# Altium project Remote.PrjPcb
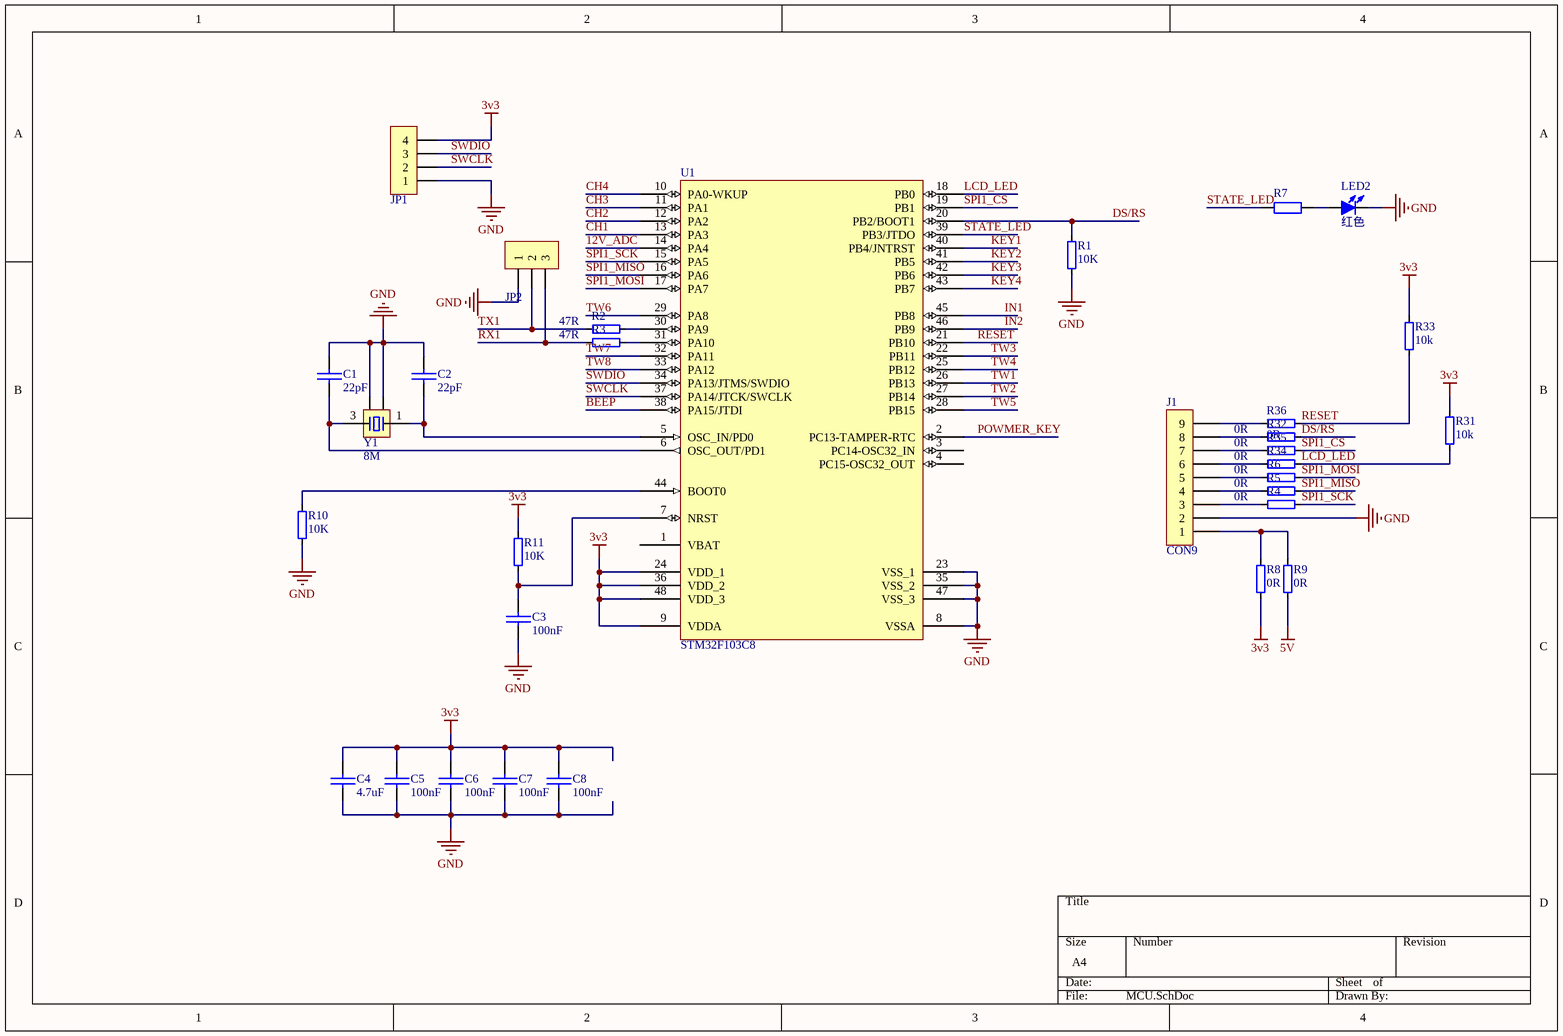
[diagram p0: MCU.SchDoc]
4 sheets, 142 parts. Net scope: global (net labels, ports and power ports of the same name join across sheets).
Board file: Remote.PcbDoc
Sheets:
  MCU.SchDoc
  INPUT.SchDoc
  COMMUNICATION.SchDoc
  POWER.SchDoc

## Sheet MCU.SchDoc
size A4; SheetNumber: 1; SheetTotal: 4

### Parts
(Parts that share a designator on the sheet are numbered #1, #2 ... from top to bottom, then left to right.)
C1  22pF  [C 0603_L]
C2  22pF  [C 0603_L]
C3  100nF  [C 0603_L]
C4  4.7uF  [C 0603_L]
C5  100nF  [C 0603_L]
C6  100nF  [C 0603_L]
C7  100nF  [C 0603_L]
C8  100nF  [C 0603_L]
J1  CON9  [HDR2.54-Y-LI-9P]
JP1  HDR-1X4  [HDR2.54-LI-4P]  (value not drawn)
JP2  HDR-1X3  [HDR2.54-LI-3P]  (value not drawn)
LED2  红色  [LED 0805G]
R1  10K  [R 0603_L]
R2  47R  [R 0603_L]
R3  47R  [R 0603_L]
R4  0R  [R 0603_L]
R5  0R  [R 0603_L]
R6  0R  [R 0603_L]
R7  (no value)  [R 0603_L]
R8  0R  [R 0603_L]
R9  0R  [R 0603_L]
R10  10K  [R 0603_L]
R11  10K  [R 0603_L]
R31  10k  [R 0603_L]
R32  0R  [R 0603_L]
R33  10k  [R 0603_L]
R34#1  0R  [R 0603_L]
R35#1  0R  [R 0603_L]
R36#1  0R  [R 0603_L]
U1  STM32F103C8  [LQFP-48_M]
Y1  8M  [OSC 3225-4P]

### Nets
3v3: C4.1 C5.1 C6.1 C7.1 C8.1 JP1.4 R8.2 R11.2 R31.1 R33.1 U1.9(VDDA) U1.24(VDD_1) U1.36(VDD_2) U1.48(VDD_3)
5V: R9.2
GND: C1.1 C2.1 C3.2 C4.2 C5.2 C6.2 C7.2 C8.2 J1.2 JP1.1 JP2.1 LED2.2(K) R1.2 R10.1 U1.8(VSSA) U1.23(VSS_1) U1.35(VSS_2) U1.47(VSS_3) Y1.2 Y1.4
12V_ADC: U1.14(PA4)
BEEP: U1.38(PA15/JTDI)
CH1: U1.13(PA3)
CH2: U1.12(PA2)
CH3: U1.11(PA1)
CH4: U1.10(PA0-WKUP)
DS/RS: R1.1 R32.1 U1.20(PB2/BOOT1)
IN1: U1.45(PB8)
IN2: U1.46(PB9)
KEY1: U1.40(PB4/JNTRST)
KEY2: U1.41(PB5)
KEY3: U1.42(PB6)
KEY4: U1.43(PB7)
LCD_LED: R31.2 R34#1.1 U1.18(PB0)
POWMER_KEY: U1.2(PC13-TAMPER-RTC)
RESET: R33.2 R36#1.2 U1.21(PB10)
RX1: JP2.3 R3.2
SPI1_CS: R35#1.1 U1.19(PB1)
SPI1_MISO: R5.1 U1.16(PA6)
SPI1_MOSI: R6.1 U1.17(PA7)
SPI1_SCK: R4.1 U1.15(PA5)
STATE_LED: R7.1 U1.39(PB3/JTDO)
SWCLK: JP1.2 U1.37(PA14/JTCK/SWCLK)
SWDIO: JP1.3 U1.34(PA13/JTMS/SWDIO)
TW1: U1.26(PB13)
TW2: U1.27(PB14)
TW3: U1.22(PB11)
TW4: U1.25(PB12)
TW5: U1.28(PB15)
TW6: U1.29(PA8)
TW7: U1.32(PA11)
TW8: U1.33(PA12)
TX1: JP2.2 R2.2
NetC1_2: C1.2 U1.6(OSC_OUT/PD1) Y1.3
NetC2_2: C2.2 U1.5(OSC_IN/PD0) Y1.1
NetC3_1: C3.1 R11.1 U1.7(NRST)
NetJ1_1: J1.1 R8.1 R9.1
NetJ1_3: J1.3 R4.2
NetJ1_4: J1.4 R5.2
NetJ1_5: J1.5 R6.2
NetJ1_6: J1.6 R34#1.2
NetJ1_7: J1.7 R35#1.2
NetJ1_8: J1.8 R32.2
NetJ1_9: J1.9 R36#1.1
NetLED2_1: LED2.1(A) R7.2
NetR2_1: R2.1 U1.30(PA9)
NetR3_1: R3.1 U1.31(PA10)
NetR10_2: R10.2 U1.44(BOOT0)

Not connected (* = marked no-connect by the designer): U1 1(VBAT) 3(PC14-OSC32_IN) 4(PC15-OSC32_OUT)

### Library data of the parts
C1-C8 = 普通电容: Capacitor
J1 = CON9: Connector
JP1 = Header 4: 4P接插件; 版权归属: 源创客; BOM名称: 4P接插件; 学习资源: www.ooocke.com
JP2 = Header 3: 3P接插件; 版权归属: 源创客; BOM名称: 3P接插件; 学习资源: www.ooocke.com
LED2 = LED-SMD: 贴片LED; 版权归属: 源创客; BOM名称: 贴片LED; 学习资源: www.ooocke.com
R1-R6 R8-R11 R31-R33 R34#1 R35#1 R36#1 = 普通电阻
R7 = R: 贴片电阻; 版权归属: 源创客; BOM名称: 贴片电阻; 学习资源: www.ooocke.com
U1 = STM32F103C8: Flaah:64/RAM:20/IO:36; BOM名称: 32位STM单片机; 版权归属: 源创客; 学习资源: www.ooocke.com
Y1 = XTAL-4P: 4脚无源晶振; 版权归属: 源创客; BOM名称: 4脚无源晶振; 学习资源: www.ooocke.com

## Sheet INPUT.SchDoc
size A4; SheetNumber: 2; SheetTotal: 4
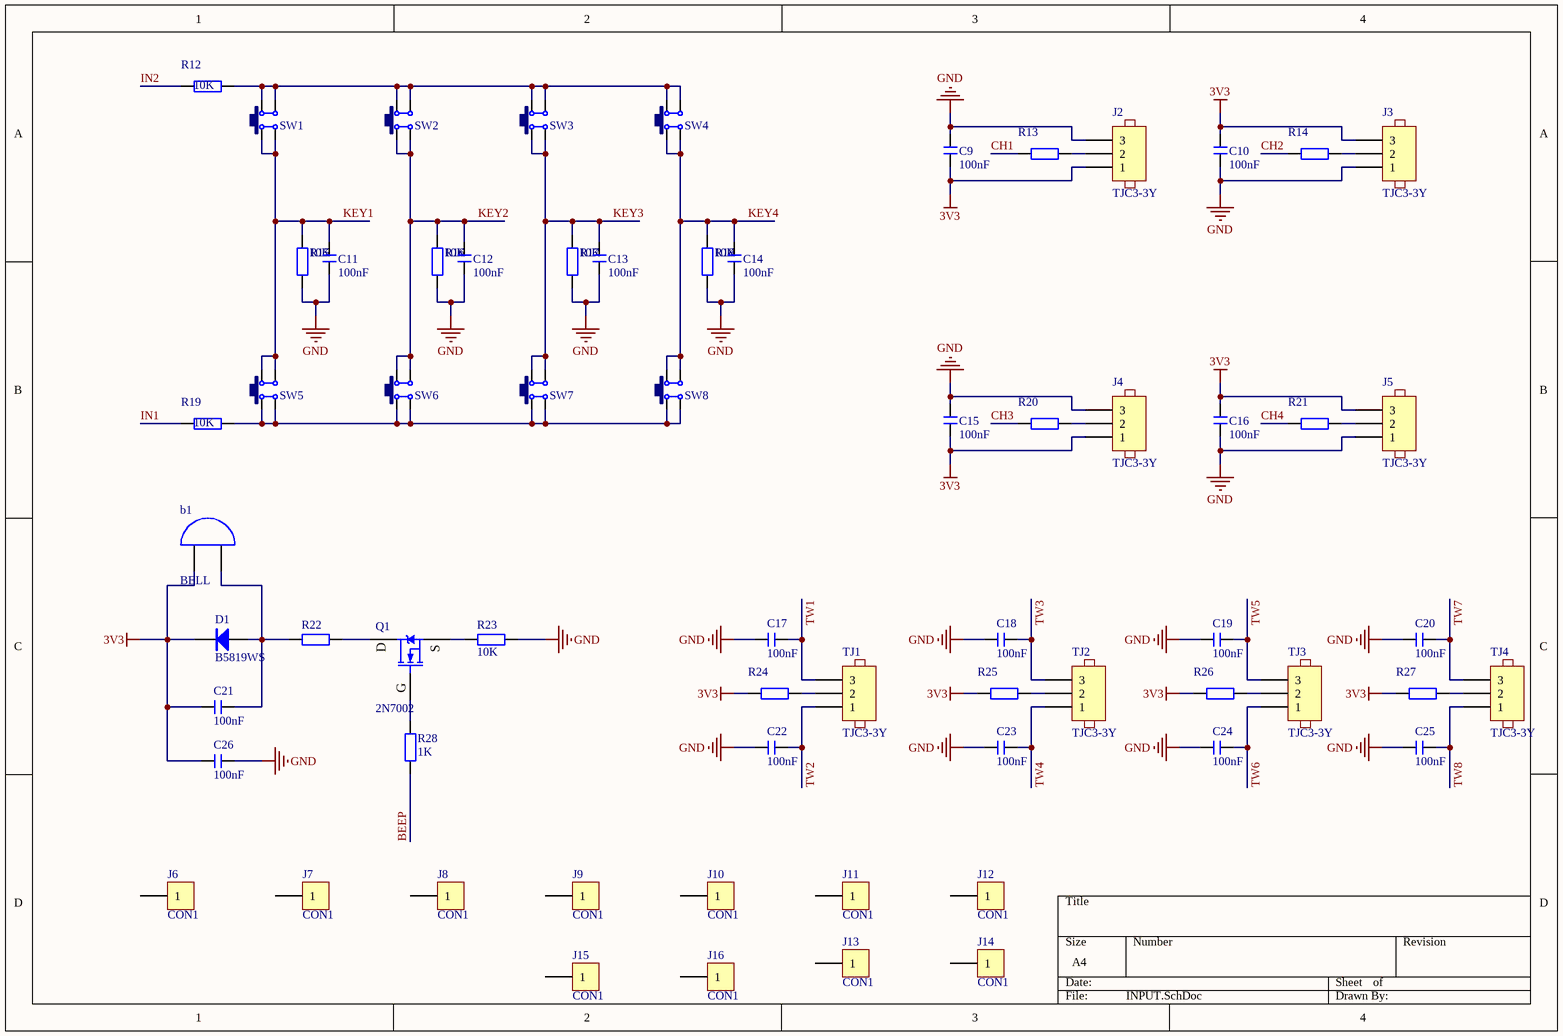
[diagram p1: INPUT.SchDoc]

### Parts
b1  BELL  [BEEP 5x9x5.5]
C9  100nF  [C 0603_L]
C10  100nF  [C 0603_L]
C11  100nF  [C 0603_L]
C12  100nF  [C 0603_L]
C13  100nF  [C 0603_L]
C14  100nF  [C 0603_L]
C15  100nF  [C 0603_L]
C16  100nF  [C 0603_L]
C17  100nF  [C 0603_L]
C18  100nF  [C 0603_L]
C19  100nF  [C 0603_L]
C20  100nF  [C 0603_L]
C21  100nF  [C 0603_L]
C22  100nF  [C 0603_L]
C23  100nF  [C 0603_L]
C24  100nF  [C 0603_L]
C25  100nF  [C 0603_L]
C26  100nF  [C 0603_L]
D1  B5819WS  [SOD-323]
J2  TJC3-3Y  [MX 1.25-LS-3P]
J3  TJC3-3Y  [MX 1.25-LS-3P]
J4  TJC3-3Y  [MX 1.25-LS-3P]
J5  TJC3-3Y  [MX 1.25-LS-3P]
J6  CON1  [M3x5+6_L]
J7  CON1  [M3x5+6_L]
J8  CON1  [M3x5+6_L]
J9  CON1  [M3x5+6_L]
J10  CON1  [M3x5+6_L]
J11  CON1  [M3x5+6_L]
J12  CON1  [M3x5+6_L]
J13  CON1  [M3x5+6_L]
J14  CON1  [M3x5+6_L]
J15  CON1  [M3x5+6_L]
J16  CON1  [M3x5+6_L]
Q1  2N7002  [SOT-23]
R12  10K  [R 0603_L]
R13  (no value)  [R 0603_L]
R14  (no value)  [R 0603_L]
R15  10K  [R 0603_L]
R16  10K  [R 0603_L]
R17  10K  [R 0603_L]
R18  10K  [R 0603_L]
R19  10K  [R 0603_L]
R20  (no value)  [R 0603_L]
R21  (no value)  [R 0603_L]
R22  (no value)  [R 0603_L]
R23  10K  [R 0603_L]
R24  (no value)  [R 0603_L]
R25  (no value)  [R 0603_L]
R26  (no value)  [R 0603_L]
R27  (no value)  [R 0603_L]
R28  1K  [R 0603_L]
SW1  6x6x5  [TSW SMD-6*6*5-L]  (value not drawn)
SW2  6x6x5  [TSW SMD-6*6*5-L]  (value not drawn)
SW3  6x6x5  [TSW SMD-6*6*5-L]  (value not drawn)
SW4  6x6x5  [TSW SMD-6*6*5-L]  (value not drawn)
SW5  6x6x5  [TSW SMD-6*6*5-L]  (value not drawn)
SW6  6x6x5  [TSW SMD-6*6*5-L]  (value not drawn)
SW7  6x6x5  [TSW SMD-6*6*5-L]  (value not drawn)
SW8  6x6x5  [TSW SMD-6*6*5-L]  (value not drawn)
TJ1  TJC3-3Y  [MX 1.25-LS-3P]
TJ2  TJC3-3Y  [MX 1.25-LS-3P]
TJ3  TJC3-3Y  [MX 1.25-LS-3P]
TJ4  TJC3-3Y  [MX 1.25-LS-3P]

### Nets
3v3: b1.1 C9.1 C10.2 C15.1 C16.2 C21.2 C26.2 D1.2(K) J2.1 J3.3 J4.1 J5.3 R24.2 R25.2 R26.2 R27.2
GND: C9.2 C10.1 C11.1 C12.1 C13.1 C14.1 C15.2 C16.1 C17.2 C18.2 C19.2 C20.2 C22.2 C23.2 C24.2 C25.2 C26.1 J2.3 J3.1 J4.3 J5.1 R15.2 R16.2 R17.2 R18.2 R23.1
BEEP: R28.1
CH1: R13.2
CH2: R14.2
CH3: R20.2
CH4: R21.2
IN1: R19.2
IN2: R12.2
KEY1: C11.2 R15.1 SW1.1 SW1.4 SW5.2 SW5.3
KEY2: C12.2 R16.1 SW2.1 SW2.4 SW6.2 SW6.3
KEY3: C13.2 R17.1 SW3.1 SW3.4 SW7.2 SW7.3
KEY4: C14.2 R18.1 SW4.1 SW4.4 SW8.2 SW8.3
TW1: C17.1 TJ1.3
TW2: C22.1 TJ1.1
TW3: C18.1 TJ2.3
TW4: C23.1 TJ2.1
TW5: C19.1 TJ3.3
TW6: C24.1 TJ3.1
TW7: C20.1 TJ4.3
TW8: C25.1 TJ4.1
Netb1_2: b1.2 C21.1 D1.1(A) R22.1
NetJ2_2: J2.2 R13.1
NetJ3_2: J3.2 R14.1
NetJ4_2: J4.2 R20.1
NetJ5_2: J5.2 R21.1
NetQ1_1: Q1.1(G) R28.2
NetQ1_2: Q1.2(D) R22.2
NetQ1_3: Q1.3(S) R23.2
NetR12_1: R12.1 SW1.2 SW1.3 SW2.2 SW2.3 SW3.2 SW3.3 SW4.2 SW4.3
NetR19_1: R19.1 SW5.1 SW5.4 SW6.1 SW6.4 SW7.1 SW7.4 SW8.1 SW8.4
NetR24_1: R24.1 TJ1.2
NetR25_1: R25.1 TJ2.2
NetR26_1: R26.1 TJ3.2
NetR27_1: R27.1 TJ4.2

Not connected (* = marked no-connect by the designer): J6 1; J7 1; J8 1; J9 1; J10 1; J11 1; J12 1; J13 1; J14 1; J15 1; J16 1

### Library data of the parts
C9-C26 = C: 无极性贴片电容; 版权归属: 源创客; BOM名称: 无极性贴片电容; 学习资源: www.ooocke.com
D1 = SR540: 肖特基二极管                           电压:40V 电流:1A                 C7420331; BOM名称: 整流二极管; 版权归属: 源创客; 属性: 40V  5A; 学习资源: www.ooocke.com
J2-J5 TJ1-TJ4 = TJC3-3Y: HCZZ0015-3             C7433469; Set Position: 0.5; Published: 8-Jun-2000; LatestRevisionDate: 17-Jul-2002; LatestRevisionNote: Re-released for DXP Platform.; PackageReference: AXIAL-0.6; Publisher: Altium Limited
Q1 = IRF840: N沟场效应管; pin to pad: 2>3 3>2; 版权归属: 源创客; BOM名称: N沟场效应管; 学习资源: www.ooocke.com
R12-R28 = R: 贴片电阻; 版权归属: 源创客; BOM名称: 贴片电阻; 学习资源: www.ooocke.com
SW1-SW8 = TSW SMD-6x6: KH-6X6X5H-STM     C2837531; pin to pad: 3>0 4>0; BOM名称: 贴片6x6轻触开关; 版权归属: 源创客; 学习资源: www.ooocke.com

## Sheet COMMUNICATION.SchDoc
size A4; SheetNumber: 3; SheetTotal: 4
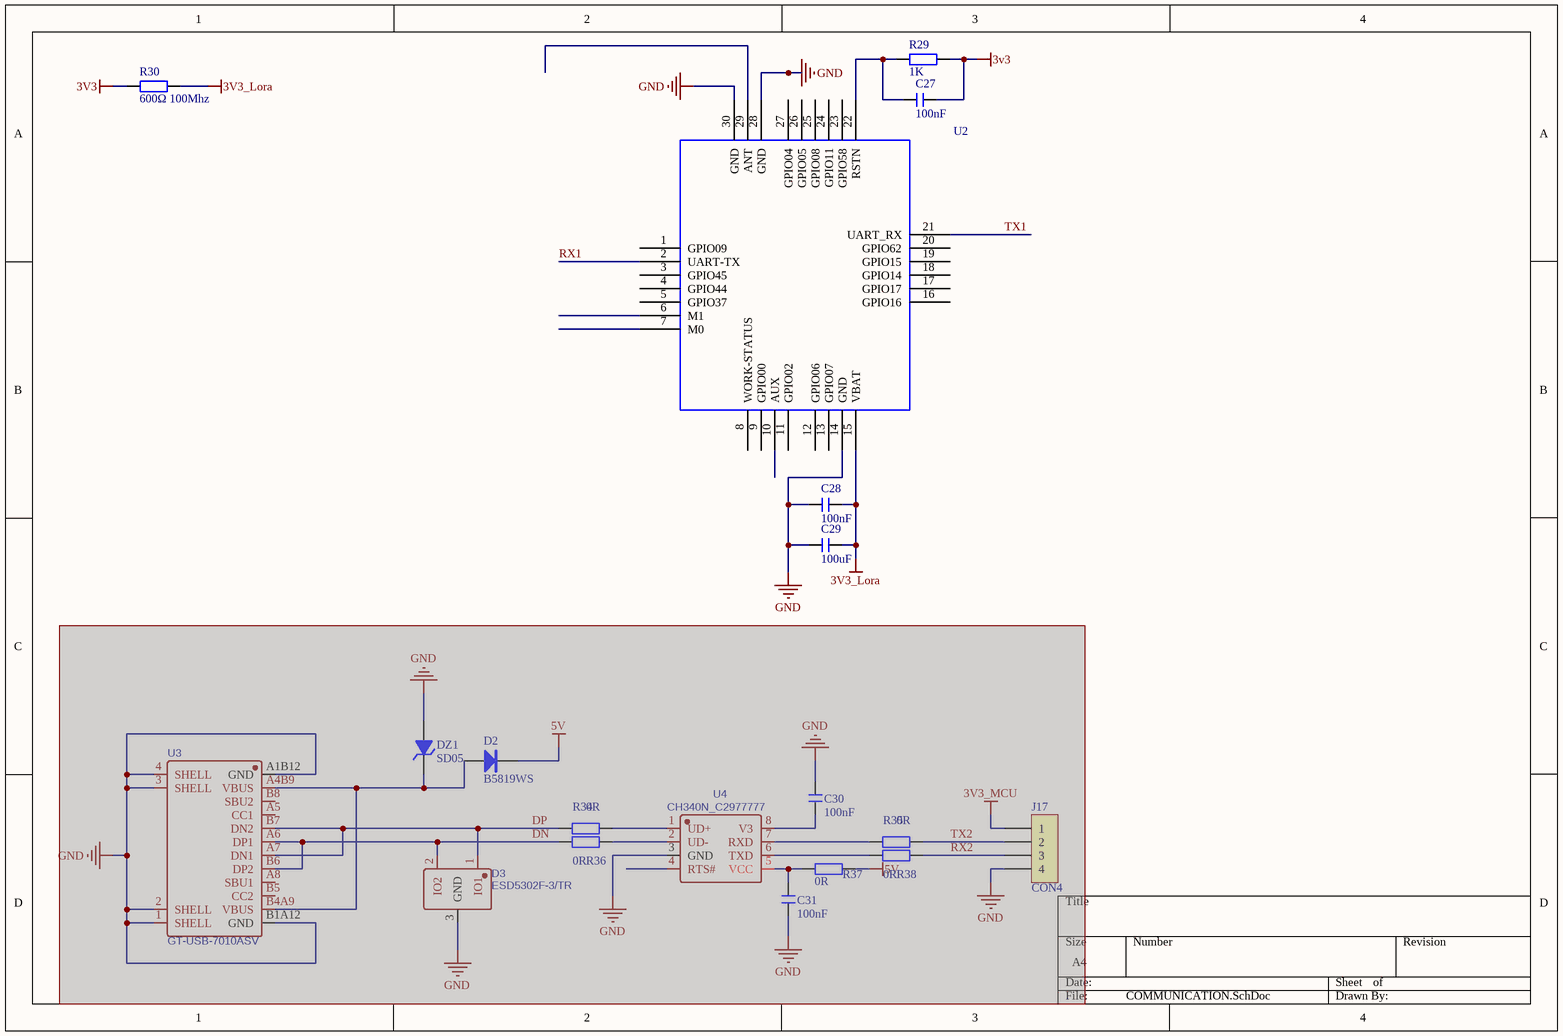
[diagram p2: COMMUNICATION.SchDoc]

### Parts
(Parts that share a designator on the sheet are numbered #1, #2 ... from top to bottom, then left to right.)
C27  100nF  [C 0603_L]
C28  100nF  [C 0603_L]
C29  100uF  [C 0603_L]
C30  100nF  [C 0603_L]  (masked out: inside a compile mask, not in the netlist)
C31  100nF  [C 0603_L]  (masked out: inside a compile mask, not in the netlist)
D2  B5819WS  [SOD-323]  (masked out: inside a compile mask, not in the netlist)
D3  ESD5302F-3/TR  [SOT-23]  (masked out: inside a compile mask, not in the netlist)
DZ1  SD05  [SOD-323]  (masked out: inside a compile mask, not in the netlist)
J17  CON4  [HDR2.54-LI-4P]  (masked out: inside a compile mask, not in the netlist)
R29  1K  [R 0603_L]
R30  600Ω 100Mhz  [R 0805_L]
R34#2  0R  [R 0603_L]  (masked out: inside a compile mask, not in the netlist)
R35#2  0R  [R 0603_L]  (masked out: inside a compile mask, not in the netlist)
R36#2  0R  [R 0603_L]  (masked out: inside a compile mask, not in the netlist)
R37  0R  [R 0603_L]  (masked out: inside a compile mask, not in the netlist)
R38  0R  [R 0603_L]  (masked out: inside a compile mask, not in the netlist)
U2  (no value)  [PCBComponent_1 - duplicate]
U3  GT-USB-7010ASV  [USB-C-SMD_G-SWITCH_GT-USB-7010ASV]  (masked out: inside a compile mask, not in the netlist)
U4  CH340N_C2977777  [SOP8]  (masked out: inside a compile mask, not in the netlist)

### Nets
3v3: C27.1 R29.2 R30.1
3V3_Lora: C28.2 C29.2 R30.2 U2.15(VBAT)
GND: C28.1 C29.1 U2.14(GND) U2.28(GND) U2.30(GND)
RX1: U2.2(UART-TX)
TX1: U2.21(UART_RX)
NetC27_2: C27.2 R29.1 U2.22(RSTN)

Not connected (* = marked no-connect by the designer): U2 1(GPIO09) 3(GPIO45) 4(GPIO44) 5(GPIO37) 6(M1) 7(M0) 8(WORK-STATUS) 9(GPIO00) 10(AUX) 11(GPIO02) 12(GPIO06) 13(GPIO07) 16(GPIO16) 17(GPIO17) 18(GPIO14) 19(GPIO15) 20(GPIO62) 23(GPIO58) 24(GPIO11) 25(GPIO08) 26(GPIO05) 27(GPIO04) 29(ANT)

### Library data of the parts
C27-C31 = C: 无极性贴片电容; 版权归属: 源创客; BOM名称: 无极性贴片电容; 学习资源: www.ooocke.com
D2 = SR540: as D1 on sheet INPUT; 学习资源: www.ooocke.com
D3 = ESD5302F-3/TR: 单向TVS 5V截止 峰值浪涌电流：4A@8/20us                        C239643; Manufacturer: WILLSEMI(韦尔); Contributor: LCSC; Supplier: LCSC; Supplier Part: C239643; Manufacturer Part: ESD5302F-3/TR; JLCPCB Part Class: Extended Part; spicePre: D; spiceSymbolName: ESD5302F-3/TR
DZ1 = 1N4106: 单向TVS 5V截止 峰值脉冲电流：17A              C502527; BOM名称: 12V/0.5W稳压管; 版权归属: 源创客; 学习资源: www.ooocke.com
J17 = CON4: Connector
R29 R34#2 R35#2 R36#2 R37 R38 = R: 贴片电阻; 版权归属: 源创客; BOM名称: 贴片电阻; 学习资源: www.ooocke.com
R30 = R: 磁珠; BOM名称: 贴片电阻; 版权归属: 源创客; 学习资源: www.ooocke.com
U2 = Component_1
U3 = GT-USB-7010ASV: Type-C 母 卧贴                板上16pin，有柱无弹，L7.35 CH1.68mm，3A电流                         C2988369; Manufacturer: G-Switch(品赞); Contributor: lcsc; Supplier: LCSC; Supplier Part: C2988369; Manufacturer Part: GT-USB-7010ASV; JLCPCB Part Class: Extended Part; spicePre: U; spiceSymbolName: GT-USB-7010ASV
U4 = CH340N_C2977777: Manufacturer: WCH(南京沁恒); Manufacturer Part: CH340N; Contributor: LCSC; Supplier: LCSC; Supplier Part: C2977777; JLCPCB Part Class: Extended Part; spicePre: U; spiceSymbolName: CH340N_C2977777

## Sheet POWER.SchDoc
size A4; SheetNumber: 4; SheetTotal: 4
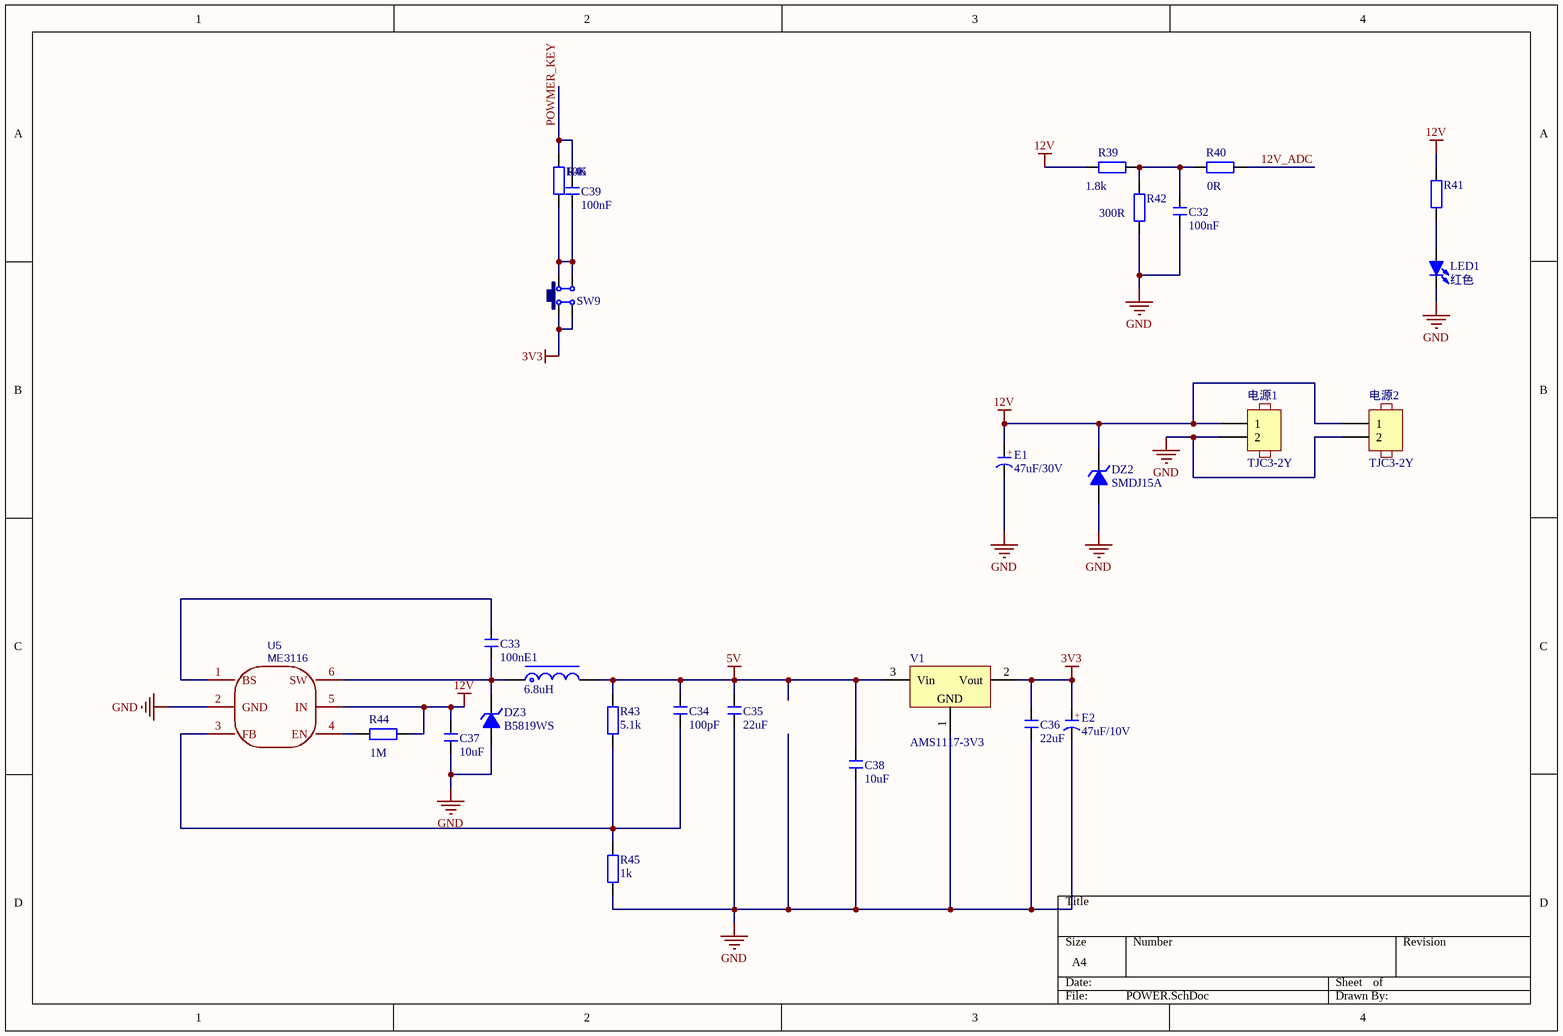
[diagram p3: POWER.SchDoc]

### Parts
C32  100nF  [C 0805_L]
C33  100nF  [C 0805_L]
C34  100pF  [C 0805_L]
C35  22uF  [C 0805_L]
C36  22uF  [C 0805_L]
C37  10uF  [C 0805_L]
C38  10uF  [C 0805_L]
C39  100nF  [C 0603_L]
DZ2  SMDJ15A  [SMC]
DZ3  B5819WS  [SOD-323]
E1  47uF/30V  [CM D(6.3*7.7)]
E2  47uF/10V  [CM B(4*5.4)]
L1  6.8uH  [CD42]
LED1  红色  [LED 0805R]
R39  1.8k  [R 0805_L]
R40  0R  [R 0805_L]
R41  (no value)  [R 0805_L]
R42  300R  [R 0805_L]
R43  5.1k  [R 0805_L]
R44  1M  [R 0805_L]
R45  1k  [R 0805_L]
R46  10K  [R 0603_L]
SW9  6x6x5  [Model Name]  (value not drawn)
U5  ME3116  [SOT23-6]
V1  AMS1117-3V3  [SOT-223]
电源1  TJC3-2Y  [MX 1.25-WS-2P]
电源2  TJC3-2Y  [MX 1.25-WS-2P]

### Nets
3v3: C36.2 E2.1(A) SW9.1 SW9.4 V1.2(Vout)
5V: C34.2 C35.2 C38.2 L1.2 R43.2 V1.3(Vin)
12V: C37.2 DZ2.2(K) E1.1(A) R39.2 R41.1 R44.1 U5.5(IN) 电源1.1 电源2.1
GND: C32.1 C35.1 C36.1 C37.1 C38.1 DZ2.1(A) DZ3.1(A) E1.2(K) E2.2(K) LED1.2(K) R42.2 R45.1 U5.2(GND) V1.1(GND) 电源1.2 电源2.2
12V_ADC: R40.2
POWMER_KEY: C39.2 R46.1
NetC32_2: C32.2 R39.1 R40.1 R42.1
NetC33_1: C33.1 DZ3.2(K) L1.1 U5.6(SW)
NetC33_2: C33.2 U5.1(BS)
NetC34_1: C34.1 R43.1 R45.2 U5.3(FB)
NetC39_1: C39.1 R46.2 SW9.2 SW9.3
NetLED1_1: LED1.1(A) R41.2
NetR44_2: R44.2 U5.4(EN)

### Notes on the sheet
- (in symbol C-CS) +

### Library data of the parts
C32-C39 = C: 无极性贴片电容; 版权归属: 源创客; BOM名称: 无极性贴片电容; 学习资源: www.ooocke.com
DZ2 = 1N4106: TVS 15V截止 峰值浪涌电流：123A                   C438153; BOM名称: 12V/0.5W稳压管; 版权归属: 源创客; 学习资源: www.ooocke.com
DZ3 = 1N5256: 电压:40V 电流:1A                                C7420331; BOM名称: 30V/0.5W稳压管; 版权归属: 源创客; 学习资源: www.ooocke.com
E1 = C-CS: JVJ50V47M6x8                        47uF ±20% 50V                            C46550421; BOM名称: 直插固态电容; 版权归属: 源创客; 学习资源: www.ooocke.com
E2 = C-CS: 47uF ±20% 10V                           C48970978; BOM名称: 直插固态电容; 版权归属: 源创客; 学习资源: www.ooocke.com
L1 = L-CD: YP0402-6R8M                          C576569; BOM名称: 功率电感; 版权归属: 源创客; 学习资源: www.ooocke.com
LED1 = LED-SMD: 贴片LED; 版权归属: 源创客; BOM名称: 贴片LED; 学习资源: www.ooocke.com
R39-R46 = R: 贴片电阻; 版权归属: 源创客; BOM名称: 贴片电阻; 学习资源: www.ooocke.com
SW9 = TSW SMD-6x6: KH-6X6X5H-STM     C2837531; pin to pad: 3>0 4>0; BOM名称: 贴片6x6轻触开关; 版权归属: 源创客; 学习资源: www.ooocke.com
U5 = ME3116: ME3116AM6G / ME3116是一款内部集成了MOSFET的异步整流降压型稳压器,能够在4.75V至40V的输入电压范围内提供高达1A的负载能力。采用PWM控制模式,具有良好的瞬态响应和逐周期限流功能。在轻载条件下自动切换到PFM模式,保证较高的轻载效率。内置软启动和环路补偿,具有过热关断、输入欠压保护、BS欠压保护和短路保护。; Manufacturer: MICRONE(南京微盟); Supplier: LCSC; Manufacturer Part: ME3116AM6G; Supplier Part: C97643; JLCPCB Part Class: Extended Part; spicePre: U; spiceSymbolName: ME3116
V1 = AMS1117: 三端稳压芯片; BOM名称: 稳压芯片; 版权归属: 源创客; 学习资源: www.ooocke.com
电源1 电源2 = TJC3-2Y: Set Position: 0.5; Published: 8-Jun-2000; LatestRevisionDate: 17-Jul-2002; LatestRevisionNote: Re-released for DXP Platform.; PackageReference: AXIAL-0.6; Publisher: Altium Limited

## Nets that join several sheets
3v3: MCU (14 pins), INPUT (16 pins), COMMUNICATION (C27.1 R29.2 R30.1), POWER (5 pins)
5V: MCU (R9.2), POWER (6 pins)
GND: MCU (20 pins), INPUT (26 pins), COMMUNICATION (5 pins), POWER (16 pins)
12V_ADC: MCU (U1.14), POWER (R40.2)
BEEP: MCU (U1.38), INPUT (R28.1)
CH1: MCU (U1.13), INPUT (R13.2)
CH2: MCU (U1.12), INPUT (R14.2)
CH3: MCU (U1.11), INPUT (R20.2)
CH4: MCU (U1.10), INPUT (R21.2)
IN1: MCU (U1.45), INPUT (R19.2)
IN2: MCU (U1.46), INPUT (R12.2)
KEY1: MCU (U1.40), INPUT (6 pins)
KEY2: MCU (U1.41), INPUT (6 pins)
KEY3: MCU (U1.42), INPUT (6 pins)
KEY4: MCU (U1.43), INPUT (6 pins)
POWMER_KEY: MCU (U1.2), POWER (C39.2 R46.1)
RX1: MCU (JP2.3 R3.2), COMMUNICATION (U2.2)
TW1: MCU (U1.26), INPUT (C17.1 TJ1.3)
TW2: MCU (U1.27), INPUT (C22.1 TJ1.1)
TW3: MCU (U1.22), INPUT (C18.1 TJ2.3)
TW4: MCU (U1.25), INPUT (C23.1 TJ2.1)
TW5: MCU (U1.28), INPUT (C19.1 TJ3.3)
TW6: MCU (U1.29), INPUT (C24.1 TJ3.1)
TW7: MCU (U1.32), INPUT (C20.1 TJ4.3)
TW8: MCU (U1.33), INPUT (C25.1 TJ4.1)
TX1: MCU (JP2.2 R2.2), COMMUNICATION (U2.21)